# EAGLE board BeagleBone_Blue (EAGLE 7.4.0)
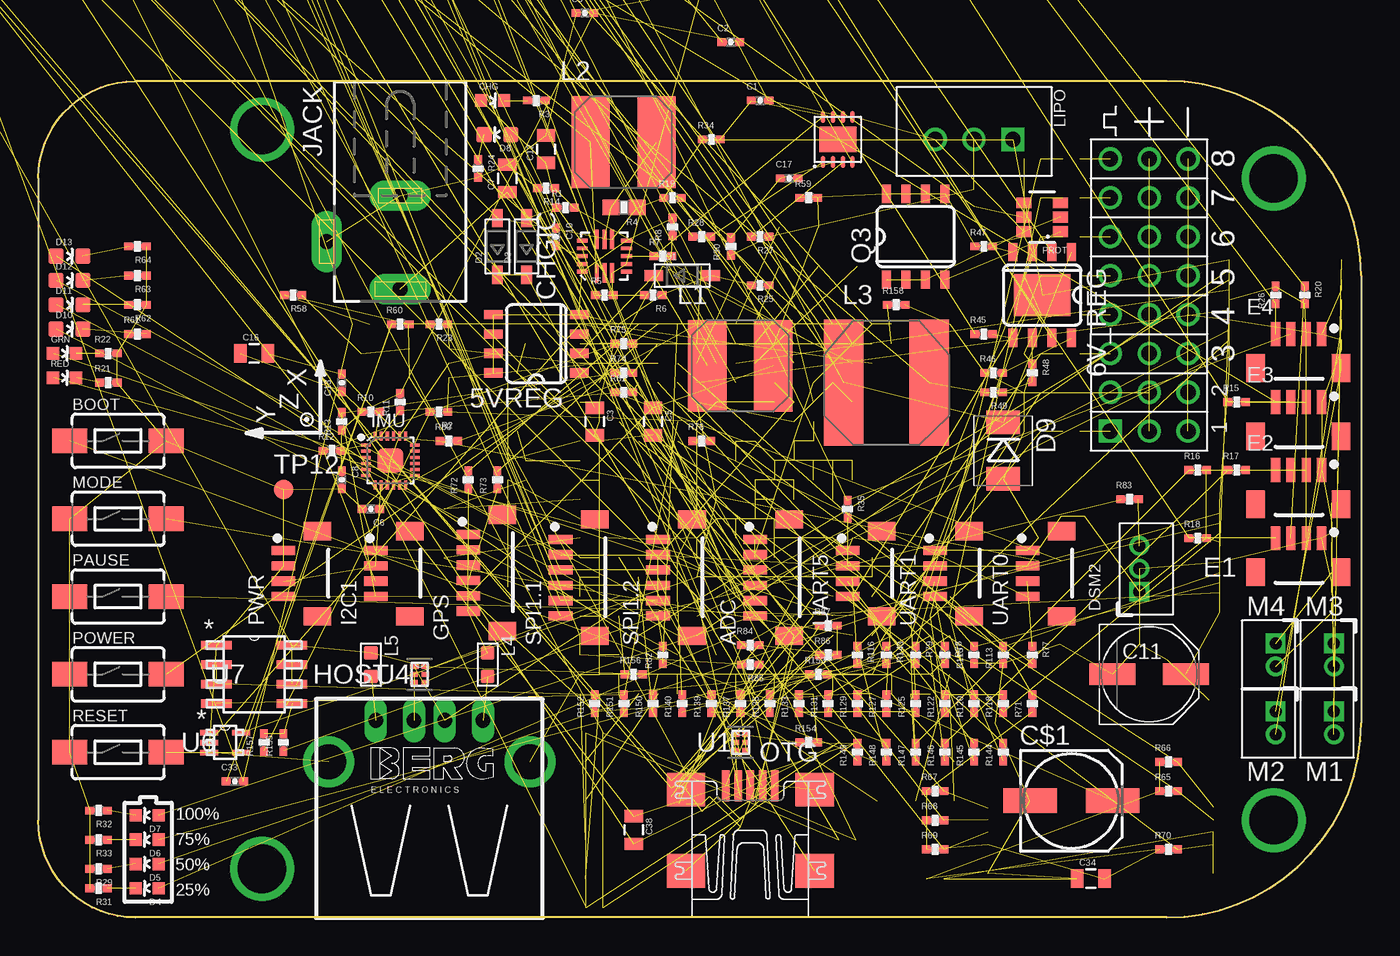
[diagram p4: board, top side]
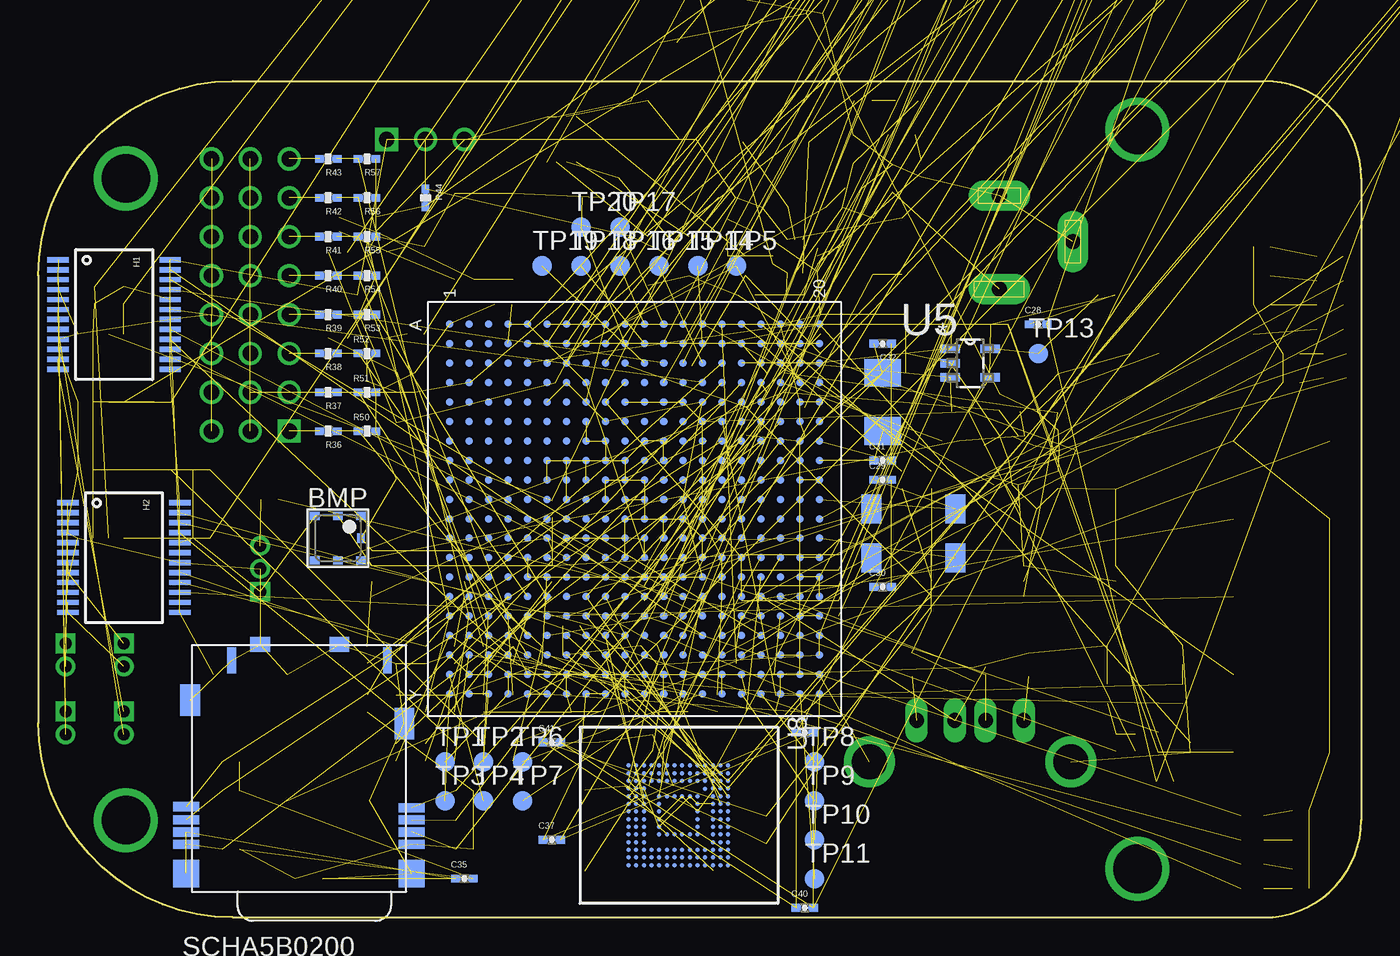
[diagram p5: board, bottom side, seen from below]

Size 86.36 x 54.61 mm. Coordinates in mm from the lower left corner, seen from the top.
Copper layers (1*16): Top 0.035mm / dielectric 1.5mm / Bottom 0.035mm
Design rules "default": minimum track width 10mil, minimum drill 24mil, track to track 8mil, track to pad 8mil, pad to pad 8mil, via to via 8mil, smd to smd 8mil, copper to edge 40mil, drill to drill 8mil, minimum pad ring 10mil, minimum via ring 8mil, stop-mask expansion 4mil, vias tented up to drill 0mil, thermal gap 10mil

## Footprints (pad centres in the part's own frame; a part is rotated, then mirrored left to right if it is on the bottom)
SO08-TIGHT = smd 0.6 x 1.2: 1 -1.905,-2.8; 2 -0.635,-2.8; 3 0.635,-2.8; 4 1.905,-2.8; 5 1.905,2.8; 6 0.635,2.8; 7 -0.635,2.8; 8 -1.905,2.8
SO08-EXPOSED = smd 0.6 x 1.2: 1 -1.905,-2.8; 2 -0.635,-2.8; 3 0.635,-2.8; 4 1.905,-2.8; 5 1.905,2.8; 6 0.635,2.8; 7 -0.635,2.8; 8 -1.905,2.8 | smd 3.683 x 2.718: 9 0,0
JST_SH_6 = smd 0.6 x 1.55: 1 5,0; 2 4,0; 3 3,0; 4 2,0; 5 1,0; 6 0,0 | smd 1.2 x 1.8: P$1 -1.3,-2.225; P$2 6.3,-2.225
8-SON_3X3MM = smd 0.305 x 0.813: 1 -0.965,-1.473; 2 -0.33,-1.473; 3 0.33,-1.473; 4 0.965,-1.473; 5 0.965,1.473; 6 0.33,1.473; 7 -0.33,1.473 | smd 0.305 x 0.787: 8 -0.965,1.473 | smd 2.4 x 1.651: PAD 0,0
BMP180 = smd 0.6 x 0.5: 1 1.5,1.45; 2 0,1.45; 3 -1.5,1.45; 4 -1.5,-1.45; 5 0,-1.45; 6 1.5,-1.45 | smd 0.5 x 0.6: 7 1.5,0
TACTILE-SWITCH-1101NE = smd 2.3 x 1.6: 1 -3.15,0; 2 3.15,0
0402-CAP = smd 0.61 x 0.508: 1 -0.559,0; 2 0.559,0
0805 = smd 0.8 x 1.2: 1 -0.9,0; 2 0.9,0
PANASONIC_D = smd 3 x 1.4: + 2.4,0; - -2.4,0
AVE107M06D16T-F = smd 3.5 x 1.6: + -10,2.54; - -15.4,2.54
LED-0603 = smd 0.8 x 0.8: A 0,-0.75; C 0,0.75
MP2615 = smd 1.295 x 0.254: 1 -1.092,0.508; 2 -1.092,0; 3 -1.092,-0.508; 9 1.092,-0.508; 10 1.092,0; 11 1.092,0.508 | smd 0.254 x 0.711: 4 -1.016,-1.448; 5 -0.508,-1.448; 6 0,-1.448; 7 0.508,-1.448; 8 1.016,-1.448; 12 1.016,1.448; 13 0.508,1.448; 14 0,1.448; 15 -0.508,1.448; 16 -1.016,1.448
SOD-123 = smd 1.2 x 0.7: A 1.85,0; C -1.85,0
LED-0603' = smd 1 x 1: A 0,-0.877; C 0,0.877
DO-214AA = smd 1.524 x 2.184: A 1.841,0; C -1.841,0
JST_ZH_3 = drill 0.787 square: P$1 0,0 | drill 0.787: P$2 1.499,0; P$3 2.997,0
JST_SH_4_SMD = smd 0.6 x 1.55: 1 0.46,1.27; 2 -0.54,1.27; 3 -1.54,1.27; 4 -2.54,1.27 | smd 1.2 x 1.8: P$1 -3.84,-0.955; P$2 1.728,-0.955
SSOP24 = smd 0.348 x 1.397: 1 -3.575,-3.656; 2 -2.925,-3.656; 3 -2.275,-3.656; 4 -1.625,-3.656; 5 -0.975,-3.656; 6 -0.325,-3.656; 7 0.325,-3.656; 8 0.975,-3.656; 9 1.625,-3.656; 10 2.275,-3.656; 11 2.925,-3.656; 12 3.575,-3.656; 13 3.575,3.656; 14 2.925,3.656; 15 2.275,3.656; 16 1.625,3.656; 17 0.975,3.656; 18 0.325,3.656; 19 -0.325,3.656; 20 -0.975,3.656; 21 -1.625,3.656; 22 -2.275,3.656; 23 -2.925,3.656; 24 -3.575,3.656
87520-0010BLF = drill 0.95 long: 1 -14.93,5.25; 2 -12.43,5.25; 3 -10.43,5.25; 4 -7.93,5.25 | drill 2.3 pad 2.9: S1 -18,2.54; S2 -4.86,2.54
QFN24G-0.4-3X3MM = smd 0.6 x 0.2: 1 -1.6,1; 2 -1.6,0.6; 3 -1.6,0.2; 4 -1.6,-0.2; 5 -1.6,-0.6; 6 -1.6,-1; 13 1.6,-1; 14 1.6,-0.6; 15 1.6,-0.2; 16 1.6,0.2; 17 1.6,0.6; 18 1.6,1 | smd 0.2 x 0.6: 7 -1,-1.6; 8 -0.6,-1.6; 9 -0.2,-1.6; 10 0.2,-1.6; 11 0.6,-1.6; 12 1,-1.6; 19 1,1.6; 20 0.6,1.6; 21 0.2,1.6; 22 -0.2,1.6; 23 -0.6,1.6; 24 -1,1.6 | smd 1.7 x 1.54: 25 0,0
DCJ0303 = drill 1 pad 2 long: 1 0,3.1; 2 4.8,0; 3 0,-3
SRN6045 = smd 2.5 x 6: 1 -2.175,-0.175; 2 2.125,-0.175
8X8MM_INDUCTOR = smd 2.591 x 8.204: 1 -2.794,0; 2 2.794,0
L0603 = smd 0.889 x 0.889: 1 -0.762,0; 2 0.762,0
JST_XH_3-PIN = drill 1 square: P$1 0,0 | drill 1: P$2 0,-2.54; P$3 0,-5.08
JST_ZH_2 = drill 0.787 pad 1.219 square: P$1 -0.749,0 | drill 0.787 pad 1.219: P$2 0.749,0
UX60SC-MB-5ST(80) = smd 2 x 0.5: 1 -11.72,4.14; 2 -11.72,3.34; 3 -11.72,2.54; 4 -11.72,1.74; 5 -11.72,0.94 | smd 2.2 x 2.5: M1 -17.27,-1.66; M2 -17.27,6.74; M3 -11.97,6.74; M4 -11.97,-1.66
SCHA5B0200 = smd 1.7 x 0.6: 1 18.78,8.437; 2 18.78,7.65; 3 18.78,6.85; 4 18.78,6.05; 5 4.08,6.05; 6 4.08,6.85; 7 4.08,7.65; 8 4.08,8.509 | smd 0.6 x 1.7: 9 7.044,18.05 | smd 0.549 x 1.7: 10 17.189,18.05 | smd 1.294 x 2.054: 11 4.334,15.456; 12 18.304,13.932 | smd 1.292 x 1: 13 8.894,19.1; 14 14.072,19.1 | smd 1.7 x 1.8: 15 4.08,4.15; 16 18.78,4.15
SOT-236 = smd 0.991 x 0.711: 1 -1.194,0.94; 2 -1.194,0; 3 -1.194,-0.94; 4 1.194,-0.94; 5 1.194,0; 6 1.194,0.94
0402-RES = smd 0.61 x 0.508: 1 -0.559,0; 2 0.559,0
0603-RES = smd 1.1 x 1: 1 -0.85,0; 2 0.85,0
OSD3358 = smd 0.5 x 0.5: A1 -12.065,-12.065; A2 -12.065,-10.795; A3 -12.065,-9.525; A4 -12.065,-8.255; A5 -12.065,-6.985; A6 -12.065,-5.715; A7 -12.065,-4.445; A8 -12.065,-3.175; A9 -12.065,-1.905; A10 -12.065,-0.635; A11 -12.065,0.635; A12 -12.065,1.905; A13 -12.065,3.175; A14 -12.065,4.445; A15 -12.065,5.715; A16 -12.065,6.985; A17 -12.065,8.255; A18 -12.065,9.525; A19 -12.065,10.795; A20 -12.065,12.065; B1 -10.795,-12.065; B2 -10.795,-10.795; B3 -10.795,-9.525; B4 -10.795,-8.255; B5 -10.795,-6.985; B6 -10.795,-5.715; B7 -10.795,-4.445; B8 -10.795,-3.175; B9 -10.795,-1.905; B10 -10.795,-0.635; B11 -10.795,0.635; B12 -10.795,1.905; B13 -10.795,3.175; B14 -10.795,4.445; B15 -10.795,5.715; B16 -10.795,6.985; B17 -10.795,8.255; B18 -10.795,9.525; B19 -10.795,10.795; B20 -10.795,12.065; C1 -9.525,-12.065; C2 -9.525,-10.795; C3 -9.525,-9.525; C4 -9.525,-8.255; C5 -9.525,-6.985; C6 -9.525,-5.715; C7 -9.525,-4.445; C8 -9.525,-3.175; C9 -9.525,-1.905; C10 -9.525,-0.635; C11 -9.525,0.635; C12 -9.525,1.905; C13 -9.525,3.175; C14 -9.525,4.445; C15 -9.525,5.715; C16 -9.525,6.985; C17 -9.525,8.255; C18 -9.525,9.525; C19 -9.525,10.795; C20 -9.525,12.065; D1 -8.255,-12.065; D2 -8.255,-10.795; D3 -8.255,-9.525; D4 -8.255,-8.255; D5 -8.255,-6.985; D6 -8.255,-5.715; D7 -8.255,-4.445; D8 -8.255,-3.175; D9 -8.255,-1.905; D10 -8.255,-0.635; D11 -8.255,0.635; D12 -8.255,1.905; D13 -8.255,3.175; D14 -8.255,4.445; D15 -8.255,5.715; D16 -8.255,6.985; D17 -8.255,8.255; D18 -8.255,9.525; D19 -8.255,10.795; D20 -8.255,12.065; E1 -6.985,-12.065; E2 -6.985,-10.795; E3 -6.985,-9.525; E4 -6.985,-8.255; E5 -6.985,-6.985; E6 -6.985,-5.715; E7 -6.985,-4.445; E8 -6.985,-3.175; E9 -6.985,-1.905; E10 -6.985,-0.635; E11 -6.985,0.635; E12 -6.985,1.905; E13 -6.985,3.175; E14 -6.985,4.445; E15 -6.985,5.715; E16 -6.985,6.985; E17 -6.985,8.255; E18 -6.985,9.525; E19 -6.985,10.795; E20 -6.985,12.065; F1 -5.715,-12.065; F2 -5.715,-10.795; F3 -5.715,-9.525; F4 -5.715,-8.255; F5 -5.715,-6.985; F6 -5.715,-5.715; F7 -5.715,-4.445; F8 -5.715,-3.175; F9 -5.715,-1.905; F10 -5.715,-0.635; F11 -5.715,0.635; F12 -5.715,1.905; F13 -5.715,3.175; F14 -5.715,4.445; F15 -5.715,5.715; F16 -5.715,6.985; F17 -5.715,8.255; F18 -5.715,9.525; F19 -5.715,10.795; F20 -5.715,12.065; G1 -4.445,-12.065; G2 -4.445,-10.795; G3 -4.445,-9.525; G4 -4.445,-8.255; G5 -4.445,-6.985; G6 -4.445,-5.715; G7 -4.445,-4.445; G8 -4.445,-3.175; G9 -4.445,-1.905; G10 -4.445,-0.635; G11 -4.445,0.635; G12 -4.445,1.905; G13 -4.445,3.175; G14 -4.445,4.445; G15 -4.445,5.715; G16 -4.445,6.985; G17 -4.445,8.255; G18 -4.445,9.525; G19 -4.445,10.795; G20 -4.445,12.065; H1 -3.175,-12.065; H2 -3.175,-10.795; H3 -3.175,-9.525; H4 -3.175,-8.255; H5 -3.175,-6.985; H6 -3.175,-5.715; H7 -3.175,-4.445; H8 -3.175,-3.175; H9 -3.175,-1.905; H10 -3.175,-0.635; H11 -3.175,0.635; H12 -3.175,1.905; H13 -3.175,3.175; H14 -3.175,4.445; H15 -3.175,5.715; H16 -3.175,6.985; H17 -3.175,8.255; H18 -3.175,9.525; H19 -3.175,10.795; H20 -3.175,12.065; J1 -1.905,-12.065; J2 -1.905,-10.795; J3 -1.905,-9.525; J4 -1.905,-8.255; J5 -1.905,-6.985; J6 -1.905,-5.715; J7 -1.905,-4.445; J8 -1.905,-3.175; J9 -1.905,-1.905; J10 -1.905,-0.635; J11 -1.905,0.635; J12 -1.905,1.905; J13 -1.905,3.175; J14 -1.905,4.445; J15 -1.905,5.715; J16 -1.905,6.985; J17 -1.905,8.255; J18 -1.905,9.525; J19 -1.905,10.795; J20 -1.905,12.065; K1 -0.635,-12.065; K2 -0.635,-10.795; K3 -0.635,-9.525; K4 -0.635,-8.255; K5 -0.635,-6.985; K6 -0.635,-5.715; K7 -0.635,-4.445; K8 -0.635,-3.175; K9 -0.635,-1.905; K10 -0.635,-0.635; K11 -0.635,0.635; K12 -0.635,1.905; K13 -0.635,3.175; K14 -0.635,4.445; K15 -0.635,5.715; K16 -0.635,6.985; K17 -0.635,8.255; K18 -0.635,9.525; K19 -0.635,10.795; K20 -0.635,12.065; L1 0.635,-12.065; L2 0.635,-10.795; L3 0.635,-9.525; L4 0.635,-8.255; L5 0.635,-6.985; L6 0.635,-5.715; L7 0.635,-4.445; L8 0.635,-3.175; L9 0.635,-1.905; L10 0.635,-0.635; L11 0.635,0.635; L12 0.635,1.905; L13 0.635,3.175; L14 0.635,4.445; L15 0.635,5.715; L16 0.635,6.985; L17 0.635,8.255; L18 0.635,9.525; L19 0.635,10.795; L20 0.635,12.065; M1 1.905,-12.065; M2 1.905,-10.795; M3 1.905,-9.525; M4 1.905,-8.255; M5 1.905,-6.985; M6 1.905,-5.715; M7 1.905,-4.445; M8 1.905,-3.175; M9 1.905,-1.905; M10 1.905,-0.635; M11 1.905,0.635; M12 1.905,1.905; M13 1.905,3.175; M14 1.905,4.445; M15 1.905,5.715; M16 1.905,6.985; M17 1.905,8.255; M18 1.905,9.525; M19 1.905,10.795; M20 1.905,12.065; N1 3.175,-12.065; N2 3.175,-10.795; N3 3.175,-9.525; N4 3.175,-8.255; N5 3.175,-6.985; N6 3.175,-5.715; N7 3.175,-4.445; N8 3.175,-3.175; N9 3.175,-1.905; N10 3.175,-0.635; N11 3.175,0.635; N12 3.175,1.905; N13 3.175,3.175; N14 3.175,4.445; N15 3.175,5.715; N16 3.175,6.985; N17 3.175,8.255; N18 3.175,9.525; N19 3.175,10.795; N20 3.175,12.065; P1 4.445,-12.065; P2 4.445,-10.795; P3 4.445,-9.525; P4 4.445,-8.255; P5 4.445,-6.985; P6 4.445,-5.715; P7 4.445,-4.445; P8 4.445,-3.175; P9 4.445,-1.905; P10 4.445,-0.635; P11 4.445,0.635; P12 4.445,1.905; P13 4.445,3.175; P14 4.445,4.445; P15 4.445,5.715; P16 4.445,6.985; P17 4.445,8.255; P18 4.445,9.525; P19 4.445,10.795; P20 4.445,12.065; R1 5.715,-12.065; R2 5.715,-10.795; R3 5.715,-9.525; R4 5.715,-8.255; R5 5.715,-6.985; R6 5.715,-5.715; R7 5.715,-4.445; R8 5.715,-3.175; R9 5.715,-1.905; R10 5.715,-0.635; R11 5.715,0.635; R12 5.715,1.905; R13 5.715,3.175; R14 5.715,4.445; R15 5.715,5.715; R16 5.715,6.985; R17 5.715,8.255; R18 5.715,9.525; R19 5.715,10.795; R20 5.715,12.065; T1 6.985,-12.065; T2 6.985,-10.795; T3 6.985,-9.525; T4 6.985,-8.255; T5 6.985,-6.985; T6 6.985,-5.715; T7 6.985,-4.445; T8 6.985,-3.175; T9 6.985,-1.905; T10 6.985,-0.635; T11 6.985,0.635; T12 6.985,1.905; T13 6.985,3.175; T14 6.985,4.445; T15 6.985,5.715; T16 6.985,6.985; T17 6.985,8.255; T18 6.985,9.525; T19 6.985,10.795; T20 6.985,12.065; U1 8.255,-12.065; U2 8.255,-10.795; U3 8.255,-9.525; U4 8.255,-8.255; U5 8.255,-6.985; U6 8.255,-5.715; U7 8.255,-4.445; U8 8.255,-3.175; U9 8.255,-1.905; U10 8.255,-0.635; U11 8.255,0.635; U12 8.255,1.905; U13 8.255,3.175; U14 8.255,4.445; U15 8.255,5.715; U16 8.255,6.985; U17 8.255,8.255; U18 8.255,9.525; U19 8.255,10.795; U20 8.255,12.065; V1 9.525,-12.065; V2 9.525,-10.795; V3 9.525,-9.525; V4 9.525,-8.255; V5 9.525,-6.985; V6 9.525,-5.715; V7 9.525,-4.445; V8 9.525,-3.175; V9 9.525,-1.905; V10 9.525,-0.635; V11 9.525,0.635; V12 9.525,1.905; V13 9.525,3.175; V14 9.525,4.445; V15 9.525,5.715; V16 9.525,6.985; V17 9.525,8.255; V18 9.525,9.525; V19 9.525,10.795; V20 9.525,12.065; W1 10.795,-12.065; W2 10.795,-10.795; W3 10.795,-9.525; W4 10.795,-8.255; W5 10.795,-6.985; W6 10.795,-5.715; W7 10.795,-4.445; W8 10.795,-3.175; W9 10.795,-1.905; W10 10.795,-0.635; W11 10.795,0.635; W12 10.795,1.905; W13 10.795,3.175; W14 10.795,4.445; W15 10.795,5.715; W16 10.795,6.985; W17 10.795,8.255; W18 10.795,9.525; W19 10.795,10.795; W20 10.795,12.065; Y1 12.065,-12.065; Y2 12.065,-10.795; Y3 12.065,-9.525; Y4 12.065,-8.255; Y5 12.065,-6.985; Y6 12.065,-5.715; Y7 12.065,-4.445; Y8 12.065,-3.175; Y9 12.065,-1.905; Y10 12.065,-0.635; Y11 12.065,0.635; Y12 12.065,1.905; Y13 12.065,3.175; Y14 12.065,4.445; Y15 12.065,5.715; Y16 12.065,6.985; Y17 12.065,8.255; Y18 12.065,9.525; Y19 12.065,10.795; Y20 12.065,12.065
B1,27 = smd 1.27 x 1.27: TP 0,0
DRY6 = smd 0.559 x 0.305: 1 -0.355,0.5 | smd 0.508 x 0.305: 2 -0.37,0; 3 -0.37,-0.5; 4 0.37,-0.5; 5 0.37,0; 6 0.37,0.5
SOT95P290X145-5N = smd 1.27 x 0.559: 1 -1.295,0.94; 2 -1.295,0; 3 -1.295,-0.94; 4 1.295,-0.94; 5 1.295,0.94
DCK5 = smd 1.168 x 0.356: 1 -1.041,0.65; 2 -1.041,0; 3 -1.041,-0.65; 4 1.041,-0.65; 5 1.041,0.65
D8 = smd 1.981 x 0.559: 1 -2.464,1.905; 2 -2.464,0.635; 3 -2.464,-0.635; 4 -2.464,-1.905; 5 2.464,-1.905; 6 2.464,-0.635; 7 2.464,0.635; 8 2.464,1.905
MTFC4GLDEA = smd 0.3 x 0.3: A1 -3.25,3.25; A2 -2.75,3.25; A3 -2.25,3.25; A4 -1.75,3.25; A5 -1.25,3.25; A6 -0.75,3.25; A7 -0.25,3.25; A8 0.25,3.25; A9 0.75,3.25; A10 1.25,3.25; A11 1.75,3.25; A12 2.25,3.25; A13 2.75,3.25; A14 3.25,3.25; B1 -3.25,2.75; B2 -2.75,2.75; B3 -2.25,2.75; B4 -1.75,2.75; B5 -1.25,2.75; B6 -0.75,2.75; B7 -0.25,2.75; B8 0.25,2.75; B9 0.75,2.75; B10 1.25,2.75; B11 1.75,2.75; B12 2.25,2.75; B13 2.75,2.75; B14 3.25,2.75; C1 -3.25,2.25; C2 -2.75,2.25; C3 -2.25,2.25; C4 -1.75,2.25; C5 -1.25,2.25; C6 -0.75,2.25; C7 -0.25,2.25; C8 0.25,2.25; C9 0.75,2.25; C10 1.25,2.25; C11 1.75,2.25; C12 2.25,2.25; C13 2.75,2.25; C14 3.25,2.25; D1 -3.25,1.75; D2 -2.75,1.75; D3 -2.25,1.75; D4 -1.727,1.75; D12 2.25,1.75; D13 2.75,1.75; D14 3.25,1.75; E1 -3.25,1.25; E2 -2.75,1.25; E3 -2.25,1.25; E5 -1.25,1.25; E6 -0.75,1.25; E7 -0.25,1.25; E8 0.25,1.25; E9 0.75,1.25; E10 1.25,1.25; E12 2.25,1.25; E13 2.75,1.25; E14 3.25,1.25; F1 -3.25,0.75; F2 -2.75,0.75; F3 -2.25,0.75; F5 -1.25,0.75; F10 1.25,0.75; F12 2.25,0.75; F13 2.75,0.75; F14 3.25,0.75; G1 -3.25,0.25; G2 -2.75,0.25; G3 -2.25,0.25; G5 -1.25,0.25; G10 1.25,0.25; G12 2.25,0.25; G13 2.75,0.25; G14 3.25,0.25; H1 -3.25,-0.25; H2 -2.75,-0.25; H3 -2.25,-0.25; H5 -1.25,-0.25; H10 1.25,-0.25; H12 2.25,-0.25; H13 2.75,-0.25; H14 3.25,-0.25; J1 -3.25,-0.75; J2 -2.75,-0.75; J3 -2.25,-0.75; J5 -1.25,-0.75; J10 1.25,-0.75; J12 2.25,-0.75; J13 2.75,-0.75; J14 3.25,-0.75; K1 -3.25,-1.25; K2 -2.75,-1.25; K3 -2.25,-1.25; K5 -1.25,-1.25; K6 -0.75,-1.25; K7 -0.25,-1.25; K8 0.25,-1.25; K9 0.75,-1.25; K10 1.25,-1.25; K12 2.25,-1.25; K13 2.75,-1.25; K14 3.25,-1.25; L1 -3.25,-1.75; L2 -2.75,-1.75; L3 -2.25,-1.75; L12 2.25,-1.75; L13 2.75,-1.75; L14 3.25,-1.75; M1 -3.25,-2.25; M2 -2.75,-2.25; M3 -2.25,-2.25; M4 -1.75,-2.25; M5 -1.25,-2.25; M6 -0.75,-2.25; M7 -0.25,-2.25; M8 0.25,-2.25; M9 0.75,-2.25; M10 1.25,-2.25; M11 1.75,-2.25; M12 2.25,-2.25; M13 2.75,-2.25; M14 3.25,-2.25; N1 -3.25,-2.75; N2 -2.75,-2.75; N3 -2.25,-2.75; N4 -1.75,-2.75; N5 -1.25,-2.75; N6 -0.75,-2.75; N7 -0.25,-2.75; N8 0.25,-2.75; N9 0.75,-2.75; N10 1.25,-2.75; N11 1.75,-2.75; N12 2.25,-2.75; N13 2.75,-2.75; N14 3.25,-2.75; P1 -3.25,-3.25; P2 -2.75,-3.25; P3 -2.25,-3.25; P4 -1.75,-3.25; P5 -1.25,-3.25; P6 -0.75,-3.25; P7 -0.25,-3.25; P8 0.25,-3.25; P9 0.75,-3.25; P10 1.25,-3.25; P11 1.75,-3.25; P12 2.25,-3.25; P13 2.75,-3.25; P14 3.25,-3.25
3X8_0.1"_HEADER = drill 1 square: P$1 -2.54,-17.78 | drill 1: P$2 -2.54,-15.24; P$3 -2.54,-12.7; P$4 -2.54,-10.16; P$5 -2.54,-7.62; P$6 -2.54,-5.08; P$7 0,-17.78; P$8 0,-15.24; P$9 0,-12.7; P$10 0,-10.16; P$11 0,-7.62; P$12 0,-5.08; P$13 2.54,-17.78; P$14 2.54,-15.24; P$15 2.54,-12.7; P$16 2.54,-10.16; P$17 2.54,-7.62; P$18 2.54,-5.08; P$19 -2.54,-2.54; P$20 -2.54,0; P$21 0,-2.54; P$22 0,0; P$23 2.54,-2.54; P$24 2.54,0
CM200C-32.768KAZF-UT = smd 1.3 x 1.9: 1 1.27,2.54; 2 1.27,5.74; 3 6.77,2.54; 4 6.77,5.74
445C33D24M00000 = smd 1.8 x 2.4: 1 1.27,2.54; 2 5.07,2.54

## Placement (x,y rotation side)
5VREG  AP1509SOIC-8-TIGHT  [SO08-TIGHT]  32.51,37.47 90 top
6V_REG  AOZ1284  [SO08-EXPOSED]  65.53,40.64 180 top
ADC  JST_SH_6  [JST_SH_6]  46.8,19.69 90 top
BAL  BQ29209  [8-SON_3X3MM]  52.2,50.8 0 top
BMP  BMP180  [BMP180]  66.8,24.77 0 bottom
BOARD  [BEAGLEBONE_BLUE_NO_HOLES]  0,54.61 270 top
BOOT  SWITCH-MOMENTARY-2SMD-1101NE  [TACTILE-SWITCH-1101NE]  5.21,31.11 0 top
C1  0.1uF  [0402-CAP]  47.12,53.34 0 top
C2  0.1uF  [0402-CAP]  45.21,57.15 0 top
C3  10uF 25V  [0805]  36.32,32.38 270 top
C4  1uF  [0402-CAP]  42.67,60.33 0 top  (outside the outline)
C5  10uF 25V  [0805]  40.13,32.38 270 top
C6  0.1uF  [0402-CAP]  21.72,26.67 180 top
C7  10uF 25V  [0805]  30.61,48.26 90 top
C8  0.1uF  [0402-CAP]  19.81,28.57 270 top
C9  0.1uF  [0402-CAP]  35.69,59.05 0 top  (outside the outline)
C10  1uF  [0402-CAP]  33.78,44.45 270 top
C11  100uF 16V  [PANASONIC_D]  72.52,15.88 0 top
C12  10uF 25V  [0805]  33.15,50.16 90 top
C13  0.1uF  [0402-CAP]  19.81,34.92 90 top
C14  0.1uF  [0402-CAP]  -101.47,163.83 0 top  (outside the outline)
C15  0.1uF  [0402-CAP]  -104.01,163.83 0 top  (outside the outline)
C16  10uF 25V  [0805]  14.1,36.83 0 top
C17  0.1uF  [0402-CAP]  49.02,48.26 0 top
C18  0.1uF  [0402-CAP]  -109.09,163.83 0 top  (outside the outline)
C19  0.1uF  [0402-CAP]  -13.84,167.64 0 top  (outside the outline)
C20  10uF 25V  [0805]  -86.23,160.02 0 top  (outside the outline)
C21  2.2nF 50V  [0402-CAP]  -16.38,167.64 0 top  (outside the outline)
C22  0.1uF  [0402-CAP]  -18.92,167.64 0 top  (outside the outline)
C23  10uF 25V  [0805]  -90.04,160.02 0 top  (outside the outline)
C24  0.1uF  [0402-CAP]  -21.46,167.64 0 top  (outside the outline)
C25  10uF 25V  [0805]  -93.85,160.02 0 top  (outside the outline)
C26  10uF 25V  [0805]  -97.66,160.02 0 top  (outside the outline)
C27  0.1UF,6.3V  [0402-CAP]  -24,167.64 0 top  (outside the outline)
C28  0.1UF,6.3V  [0402-CAP]  21.08,38.73 0 bottom
C29  18PF,50V  [0402-CAP]  31.24,28.57 0 bottom
C30  18PF,50V  [0402-CAP]  31.24,21.59 0 bottom
C31  18PF,50V  [0402-CAP]  31.24,29.84 0 bottom
C32  18PF,50V  [0402-CAP]  31.24,37.47 180 bottom
C33  2.2UF,6.3V  [0402-CAP]  12.83,8.89 0 top
C34  10UF,10V  [0805]  68.71,2.54 0 top
C35  0.1UF,6.3V  [0402-CAP]  58.55,2.54 0 bottom
C36  2.2UF,6.3V  [0402-CAP]  -44.32,167.64 0 top  (outside the outline)
C37  0.1UF,6.3V  [0402-CAP]  52.83,5.08 0 bottom
C38  10UF,10V  [0805]  38.86,5.71 270 top
C39  0.1UF,6.3V  [0402-CAP]  36.32,12.06 0 bottom
C40  0.1UF,6.3V  [0402-CAP]  36.32,0.63 0 bottom
C41  0.1UF,6.3V  [0402-CAP]  52.83,11.43 0 bottom
C42  0.001UF,16V  [0402-CAP]  -57.02,167.64 0 top  (outside the outline)
C43  0.1UF,6.3V  [0402-CAP]  -59.56,167.64 0 top  (outside the outline)
C44  0.1UF,6.3V  [0402-CAP]  -62.1,167.64 0 top  (outside the outline)
C45  0.1UF,6.3V  [0402-CAP]  -64.64,167.64 0 top  (outside the outline)
C46  10UF,10V  [0805]  -63.37,160.02 0 top  (outside the outline)
C$1  AVE107M06D16T-F  [AVE107M06D16T-F]  80.14,5.08 0 top
CHG  GRN  [LED-0603]  29.65,53.34 270 top
CHGIC  MP2615  [MP2615]  36.96,43.18 90 top
D1  [SOD-123]  42.04,41.91 0 top
D2  [SOD-123]  29.97,43.81 90 top
D3  [SOD-123]  31.88,43.81 90 top
D4  RED  [LED-0603]  7.11,1.91 90 top
D5  GREEN  [LED-0603]  7.11,3.49 90 top
D6  GREEN  [LED-0603]  7.11,5.08 90 top
D7  GREEN  [LED-0603]  7.11,6.67 90 top
D8  BLUE  [LED-0603']  29.97,51.12 90 top
D9  [DO-214AA]  62.99,30.48 270 top
D10  BLUE  [LED-0603']  2.03,38.42 270 top
D11  BLUE  [LED-0603']  2.03,40 270 top
D12  BLUE  [LED-0603']  2.03,41.59 270 top
D13  BLUE  [LED-0603']  2.03,43.18 270 top
DSM2  JST_ZH_3  [JST_ZH_3]  71.88,21.27 90 top
E1  JST_SH_4  [JST_SH_4_SMD]  83.31,23.5 0 top
E2  JST_SH_4  [JST_SH_4_SMD]  83.31,27.94 0 top
E3  JST_SH_4  [JST_SH_4_SMD]  83.31,32.38 0 top
E4  JST_SH_4  [JST_SH_4_SMD]  83.31,36.83 0 top
E$1  [BATTERY_INDICATOR]  7.18,4.19 270 top
GPS  JST_SH_6  [JST_SH_6]  28.07,20 90 top
GRN  GRN  [LED-0603]  1.71,36.83 270 top
H1  TB6621FNG  [SSOP24]  81.41,39.37 270 bottom
H2  TB6621FNG  [SSOP24]  80.77,23.5 270 bottom
HOST  87520-0010BLF  [87520-0010BLF]  36.96,7.62 0 top
I2C1  JST_SH_4  [JST_SH_4_SMD]  23.3,23.5 90 top
IMU  MPU-9250  [QFN24G-0.4-3X3MM]  22.99,29.84 0 top
JACK  5.5x2.1mm  [DCJ0303]  23.62,44.13 180 top
L1  6.8uH  [SRN6045]  45.85,36.2 0 top
L2  6.8uH  [SRN6045]  38.23,50.8 0 top
L3  3.6  [8X8MM_INDUCTOR]  55.37,34.92 0 top
L4  120  [L0603]  29.34,16.51 270 top
L5  120  [L0603]  21.72,16.51 270 top
LIPO  [JST_XH_3-PIN]  63.63,50.8 270 top
M1  JST_ZH_2  [JST_ZH_2]  84.58,12.7 270 top
M2  JST_ZH_2  [JST_ZH_2]  80.77,12.7 270 top
M3  JST_ZH_2  [JST_ZH_2]  84.58,17.14 270 top
M4  JST_ZH_2  [JST_ZH_2]  80.77,17.14 270 top
MODE  SWITCH-MOMENTARY-2SMD-1101NE  [TACTILE-SWITCH-1101NE]  5.21,26.04 0 top
OTG  UX60SC-MB-5ST(80)  [UX60SC-MB-5ST(80)]  49.02,20.32 90 top
P10  SCHA5B0200  [SCHA5B0200]  80.77,-1.27 0 bottom
PAUSE  SWITCH-MOMENTARY-2SMD-1101NE  [TACTILE-SWITCH-1101NE]  5.21,20.95 0 top
POWER  SWITCH-MOMENTARY-2SMD-1101NE  [TACTILE-SWITCH-1101NE]  5.21,15.88 0 top
PROT  S-8261  [SOT-236]  65.53,45.72 180 top
PWR  JST_SH_4  [JST_SH_4_SMD]  17.27,23.5 90 top
Q3  MOSFET-N  [SO08-TIGHT]  57.28,44.45 0 top
R1  47k  [0402-RES]  34.42,46.35 0 top
R2  1.5K,1%  [0402-RES]  26.16,33.02 180 top
R3  1k  [0402-RES]  32.51,53.34 180 top
R4  0.1  [0603-RES]  38.23,46.35 180 top
R5  10k  [0402-RES]  36.96,40.64 0 top
R6  10k  [0402-RES]  40.13,40.64 180 top
R7  4.7k  [0402-RES]  40.77,43.18 0 top
R8  10k  [0402-RES]  41.4,45.09 90 top
R9  1K  [0402-RES]  33.78,62.23 0 top  (outside the outline)
R10  4.7k  [0402-RES]  21.72,33.02 0 top
R11  4.7k  [0402-RES]  23.62,33.66 90 top
R12  4.7k  [0402-RES]  19.18,30.48 0 top
R13  4.7k  [0402-RES]  19.81,32.38 90 top
R14  4.7k  [0402-RES]  33.15,47.62 180 top
R15  1K  [0402-RES]  78.23,33.66 0 top
R16  1K  [0402-RES]  75.69,29.21 0 top
R17  1K  [0402-RES]  78.23,29.21 0 top
R18  1K  [0402-RES]  75.69,24.77 0 top
R19  47k  [0402-RES]  41.4,46.99 0 top
R20  1K  [0402-RES]  82.68,40.64 270 top
R21  261  [0402-RES]  4.57,34.92 0 top
R22  261  [0402-RES]  4.57,36.83 0 top
R23  1.5K,1%  [0402-RES]  26.16,38.73 180 top
R24  4.75K,1%  [0402-RES]  28.7,48.89 270 top
R25  4.7k  [0402-RES]  47.12,41.27 180 top
R26  1K  [0402-RES]  80.77,40.64 90 top
R27  160  [0402-RES]  47.12,44.45 180 top
R28  160  [0402-RES]  43.31,44.45 0 top
R29  261  [0402-RES]  3.94,3.17 180 top
R30  261  [0402-RES]  45.21,43.81 90 top
R31  261  [0402-RES]  3.94,1.91 180 top
R32  261  [0402-RES]  3.94,6.98 180 top
R33  261  [0402-RES]  3.94,5.08 180 top
R34  160  [0402-RES]  43.94,50.8 0 top
R35  1K  [0402-RES]  52.83,26.67 270 top
R36  4.7k  [0402-RES]  67.44,31.75 180 bottom
R37  4.7k  [0402-RES]  67.44,34.29 180 bottom
R38  4.7k  [0402-RES]  67.44,36.83 180 bottom
R39  4.7k  [0402-RES]  67.44,39.37 180 bottom
R40  4.7k  [0402-RES]  67.44,41.91 180 bottom
R41  4.7k  [0402-RES]  67.44,44.45 180 bottom
R42  4.7k  [0402-RES]  67.44,46.99 180 bottom
R43  4.7k  [0402-RES]  67.44,49.53 180 bottom
R44  1k  [0402-RES]  61.09,46.99 270 bottom
R45  47k  [0402-RES]  61.72,38.1 0 top
R46  1K  [0402-RES]  62.36,35.56 0 top
R47  100k  [0402-RES]  61.72,43.81 0 top
R48  10k  [0402-RES]  64.9,35.56 270 top
R49  65k  [0402-RES]  62.36,34.29 180 top
R50  4.7k  [0402-RES]  64.9,31.75 0 bottom
R51  4.7k  [0402-RES]  64.9,34.29 0 bottom
R52  4.7k  [0402-RES]  64.9,36.83 0 bottom
R53  4.7k  [0402-RES]  64.9,39.37 180 bottom
R54  4.7k  [0402-RES]  64.9,41.91 180 bottom
R55  4.7k  [0402-RES]  64.9,44.45 180 bottom
R56  4.7k  [0402-RES]  64.9,46.99 180 bottom
R57  4.7k  [0402-RES]  64.9,49.53 180 bottom
R58  1.5K,1%  [0402-RES]  16.64,40.64 180 top
R59  4.7K,1%  [0402-RES]  50.29,46.99 0 top
R60  10K,1%  [0402-RES]  23.62,38.73 0 top
R61  261  [0402-RES]  6.48,38.1 0 top
R62  261  [0402-RES]  6.48,40 180 top
R63  261  [0402-RES]  6.48,41.91 180 top
R64  261  [0402-RES]  6.48,43.81 180 top
R65  10K,1%  [0402-RES]  73.79,8.26 0 top
R66  10K,1%  [0402-RES]  73.79,10.16 0 top
R67  10K,1%  [0402-RES]  58.55,8.26 0 top
R68  10K,1%  [0402-RES]  58.55,6.35 0 top
R69  10K,1%  [0402-RES]  58.55,4.45 0 top
R70  10K,1%  [0402-RES]  73.79,4.45 0 top
R71  10K,1%  [0402-RES]  64.9,13.97 90 top
R72  33  [0402-RES]  28.07,28.57 90 top
R73  33  [0402-RES]  29.97,28.57 90 top
R74  0  [0402-RES]  38.23,35.56 0 top
R75  0  [0402-RES]  38.23,37.47 0 top
R76  33  [0402-RES]  43.31,31.11 0 top
R77  33  [0402-RES]  64.9,17.14 270 top
R78  33  [0402-RES]  59.18,17.14 270 top
R79  33  [0402-RES]  57.28,17.14 270 top
R80  0  [0402-RES]  26.8,31.11 0 top
R81  0  [0402-RES]  38.23,34.29 0 top
R82  33  [0402-RES]  40.77,17.14 90 top
R83  33  [0402-RES]  71.25,27.3 0 top
R84  10K,1%  [0402-RES]  46.48,17.78 0 top
R85  10K,1%  [0402-RES]  46.48,16.51 180 top
R86  10K,1%  [0402-RES]  51.56,17.14 0 top
R87  10K,1%  [0402-RES]  51.56,19.05 0 top
R88  10K,1%  [0402-RES]  -92.58,172.72 0 top  (outside the outline)
R89  10K,1%  [0402-RES]  -95.12,172.72 0 top  (outside the outline)
R90  10K,1%  [0402-RES]  -97.66,172.72 0 top  (outside the outline)
R91  10K,1%  [0402-RES]  -100.2,172.72 0 top  (outside the outline)
R92  10K,1%  [0402-RES]  -102.74,172.72 0 top  (outside the outline)
R93  10K,1%  [0402-RES]  -105.28,172.72 0 top  (outside the outline)
R94  10K,1%  [0402-RES]  -107.82,172.72 0 top  (outside the outline)
R95  33  [0402-RES]  -13.84,175.26 0 top  (outside the outline)
R96  33  [0402-RES]  -16.38,175.26 0 top  (outside the outline)
R97  33  [0402-RES]  -18.92,175.26 0 top  (outside the outline)
R98  33  [0402-RES]  -21.46,175.26 0 top  (outside the outline)
R99  33  [0402-RES]  -24,175.26 0 top  (outside the outline)
R100  33  [0402-RES]  -26.54,175.26 0 top  (outside the outline)
R101  33  [0402-RES]  -29.08,175.26 0 top  (outside the outline)
R102  33  [0402-RES]  -31.62,175.26 0 top  (outside the outline)
R103  33  [0402-RES]  -34.16,175.26 0 top  (outside the outline)
R104  33  [0402-RES]  -36.7,175.26 0 top  (outside the outline)
R105  0  [0402-RES]  -39.24,175.26 0 top  (outside the outline)
R106  0  [0402-RES]  -41.78,175.26 0 top  (outside the outline)
R107  0  [0402-RES]  -44.32,175.26 0 top  (outside the outline)
R108  0  [0402-RES]  -46.86,175.26 0 top  (outside the outline)
R109  4.75K,1%  [0402-RES]  -49.4,175.26 0 top  (outside the outline)
R110  4.75K,1%  [0402-RES]  -51.94,175.26 0 top  (outside the outline)
R111  0  [0402-RES]  -54.48,175.26 0 top  (outside the outline)
R113  100K,1%  [0402-RES]  62.99,17.14 90 top
R115  100K,1%  [0402-RES]  61.09,17.14 90 top
R116  100K,1%  [0402-RES]  53.47,17.14 270 top
R118  100K,1%  [0402-RES]  62.99,13.97 90 top
R120  100K,1%  [0402-RES]  61.09,13.97 90 top
R122  100K,1%  [0402-RES]  59.18,13.97 90 top
R125  100K,1%  [0402-RES]  57.28,13.97 90 top
R127  100K,1%  [0402-RES]  55.37,13.97 90 top
R129  100K,1%  [0402-RES]  53.47,13.97 90 top
R131  100K,1%  [0402-RES]  51.56,13.97 90 top
R133  100K,1%  [0402-RES]  49.66,13.97 90 top
R135  100K,1%  [0402-RES]  47.75,13.97 90 top
R137  100K,1%  [0402-RES]  45.85,13.97 90 top
R139  100K,1%  [0402-RES]  43.94,13.97 90 top
R140  100K,1%  [0402-RES]  42.04,13.97 90 top
R143  100K,1%  [0402-RES]  55.37,17.14 270 top
R144  33  [0402-RES]  62.99,10.8 90 top
R145  33  [0402-RES]  61.09,10.8 90 top
R146  0  [0402-RES]  59.18,10.8 90 top
R147  0  [0402-RES]  57.28,10.8 90 top
R148  100  [0402-RES]  55.37,10.8 90 top
R149  0  [0402-RES]  53.47,10.8 90 top
R150  0  [0402-RES]  40.13,13.97 90 top
R151  10K,1%  [0402-RES]  38.23,13.97 90 top
R152  0  [0402-RES]  36.32,13.97 90 top
R153  0,DNI  [0402-RES]  50.93,15.88 0 top
R154  0  [0402-RES]  50.29,11.43 0 top
R155  0,DNI  [0402-RES]  16,11.43 90 top
R156  33  [0402-RES]  38.86,15.88 0 top
R157  10K,1%,DNI  [0402-RES]  14.73,11.43 90 top
R158  10K,1%  [0402-RES]  56.01,40 0 top
RED  RED  [LED-0603]  1.71,35.24 270 top
RESET  SWITCH-MOMENTARY-2SMD-1101NE  [TACTILE-SWITCH-1101NE]  5.21,10.8 0 top
SIP  OSD3358  [OSD3358]  47.43,26.67 270 bottom
SPI1.1  JST_SH_6  [JST_SH_6]  34.1,19.69 90 top
SPI1.2  JST_SH_6  [JST_SH_6]  40.45,19.69 90 top
TP1  TPSQB1,27  [B1,27]  59.82,10.16 0 bottom
TP2  TPSQB1,27  [B1,27]  57.28,10.16 0 bottom
TP3  TPSQB1,27  [B1,27]  59.82,7.62 0 bottom
TP4  TPSQB1,27  [B1,27]  57.28,7.62 0 bottom
TP5  TPSQB1,27  [B1,27]  40.77,42.55 0 bottom
TP6  TPSQB1,27  [B1,27]  54.74,10.16 0 bottom
TP7  TPSQB1,27  [B1,27]  54.74,7.62 0 bottom
TP8  TPSQB1,27  [B1,27]  35.69,10.16 0 bottom
TP9  TPSQB1,27  [B1,27]  35.69,7.62 0 bottom
TP10  TPSQB1,27  [B1,27]  35.69,5.08 0 bottom
TP11  TPSQB1,27  [B1,27]  35.69,2.54 0 bottom
TP12  TPSQB1,27  [B1,27]  16,27.94 0 top
TP13  TPSQB1,27  [B1,27]  21.08,36.83 0 bottom
TP14  TPSQB1,27  [B1,27]  43.31,42.55 0 bottom
TP15  TPSQB1,27  [B1,27]  45.85,42.55 0 bottom
TP16  TPSQB1,27  [B1,27]  48.39,42.55 0 bottom
TP17  TPSQB1,27  [B1,27]  48.39,45.09 0 bottom
TP18  TPSQB1,27  [B1,27]  50.93,42.55 0 bottom
TP19  TPSQB1,27  [B1,27]  53.47,42.55 0 bottom
TP20  TPSQB1,27  [B1,27]  50.93,45.09 0 bottom
U1  TPD4S012_DRY_6  [DRY6]  45.85,11.43 0 top
U4  TPD4S012_DRY_6  [DRY6]  24.89,15.88 0 top
U5  24LC_32AT-I/OT  [SOT95P290X145-5N]  25.53,36.2 0 bottom
U6  SN74LVC1G07_DCK_5  [DCK5]  12.19,11.43 0 top
U7  TPS2051B_D_8  [D8]  14.1,15.88 0 top
U8  MTFC4GLDEA  [MTFC4GLDEA]  44.58,6.67 270 bottom
U$1  SERVO_HEADERS_8X  [3X8_0.1"_HEADER]  72.52,49.53 0 top
U$5  [XYZ_BIG]  18.41,31.62 90 top
UART0  JST_SH_4  [JST_SH_4_SMD]  65.85,23.5 90 top
UART1  JST_SH_4  [JST_SH_4_SMD]  59.82,23.5 90 top
UART5  JST_SH_4  [JST_SH_4_SMD]  54.1,23.5 90 top
Y1  CM200C-32.768KAZF-UT  [CM200C-32.768KAZF-UT]  25.21,29.21 180 bottom
Y2  445C33D24M00000  [445C33D24M00000]  33.78,36.83 270 bottom

## Tracks (layer width: path | path; a pad name or v marks a point on that pad's centre or on a via)
3.3V  (36 unrouted)
5.0V  (7 unrouted)
AIN0  (1 unrouted)
AIN1  (1 unrouted)
AIN2  (1 unrouted)
AIN3  (1 unrouted)
BATT_MID  (3 unrouted)
BATT_MINUS  (11 unrouted)
CHG_EN  (2 unrouted)
CO  (1 unrouted)
DO  (1 unrouted)
GND  (248 unrouted)
GNDA_ADC  (5 unrouted)
I2C0_SCL  (3 unrouted)
I2C0_SDA  (3 unrouted)
I2C1_SCL  (2 unrouted)
I2C1_SDA  (2 unrouted)
I2C2_SCL  (3 unrouted)
I2C2_SDA  (3 unrouted)
IMU_INT  (1 unrouted)
L3  (1 unrouted)
L4  (1 unrouted)
LDO_PGOOD  (1 unrouted)
LED_1  (1 unrouted)
LED_2  (2 unrouted)
LED_3  (1 unrouted)
LED_4  (1 unrouted)
LED_GRN  (1 unrouted)
LED_RED  (1 unrouted)
MDIR_1A  (1 unrouted)
MDIR_1B  (1 unrouted)
MDIR_2A  (1 unrouted)
MDIR_2B  (2 unrouted)
MDIR_3A  (2 unrouted)
MDIR_3B  (3 unrouted)
MDIR_4A  (2 unrouted)
MDIR_4B  (2 unrouted)
MODE_BTN  (1 unrouted)
MOT1A  (2 unrouted)
MOT1B  (2 unrouted)
MOT2A  (2 unrouted)
MOT2B  (2 unrouted)
MOT3A  (2 unrouted)
MOT3B  (2 unrouted)
MOT4A  (2 unrouted)
MOT4B  (2 unrouted)
MOT_STBY  (2 unrouted)
N$1  (1 unrouted)
N$2  (1 unrouted)
N$3  (1 unrouted)
N$4  (3 unrouted)
N$5  (2 unrouted)
N$6  (1 unrouted)
N$7  (1 unrouted)
N$8  (2 unrouted)
N$9  (1 unrouted)
N$10  (1 unrouted)
N$11  (2 unrouted)
N$12  (2 unrouted)
N$13  (1 unrouted)
N$14  (1 unrouted)
N$15  (1 unrouted)
N$16  (2 unrouted)
N$17  (1 unrouted)
N$18  (1 unrouted)
N$19  (1 unrouted)
N$20  (1 unrouted)
N$21  (1 unrouted)
N$22  (1 unrouted)
N$23  (1 unrouted)
N$24  (1 unrouted)
N$25  (1 unrouted)
N$26  (2 unrouted)
N$27  (2 unrouted)
N$28  (2 unrouted)
N$29  (2 unrouted)
N$30  (1 unrouted)
N$31  (2 unrouted)
N$32  (2 unrouted)
N$33  (2 unrouted)
N$34  (2 unrouted)
N$35  (1 unrouted)
N$36  (1 unrouted)
N$37  (1 unrouted)
N$38  (1 unrouted)
N$39  (1 unrouted)
N$40  (1 unrouted)
N$41  (1 unrouted)
N$42  (2 unrouted)
N$43  (1 unrouted)
N$44  (1 unrouted)
N$45  (1 unrouted)
N$46  (1 unrouted)
N$47  (1 unrouted)
N$48  (1 unrouted)
N$49  (1 unrouted)
N$50  (1 unrouted)
N$51  (1 unrouted)
N$52  (1 unrouted)
N$53  (1 unrouted)
N$54  (1 unrouted)
N$55  (2 unrouted)
N$56  (1 unrouted)
N$57  (1 unrouted)
N$58  (1 unrouted)
N$59  (1 unrouted)
N$60  (3 unrouted)
N$61  (1 unrouted)
N$62  (10 unrouted)
N$63  (1 unrouted)
N$64  (2 unrouted)
N$65  (2 unrouted)
N$66  (1 unrouted)
N$67  (2 unrouted)
N$68  (1 unrouted)
N$69  (1 unrouted)
N$70  (2 unrouted)
N$71  (2 unrouted)
N$72  (1 unrouted)
N$73  (2 unrouted)
N$74  (2 unrouted)
N$75  (2 unrouted)
N$76  (1 unrouted)
N$77  (2 unrouted)
N$78  (1 unrouted)
N$79  (3 unrouted)
N$80  (1 unrouted)
N$81  (1 unrouted)
N$82  (1 unrouted)
N$83  (1 unrouted)
N$84  (1 unrouted)
N$85  (1 unrouted)
N$86  (1 unrouted)
N$87  (1 unrouted)
N$88  (2 unrouted)
N$89  (2 unrouted)
N$90  (2 unrouted)
N$91  (2 unrouted)
N$92  (2 unrouted)
N$93  (2 unrouted)
N$94  (2 unrouted)
N$95  (2 unrouted)
N$96  (2 unrouted)
N$97  (2 unrouted)
N$98  (2 unrouted)
N$99  (1 unrouted)
N$100  (1 unrouted)
N$101  (1 unrouted)
N$102  (1 unrouted)
N$103  (1 unrouted)
N$104  (1 unrouted)
N$105  (1 unrouted)
N$106  (1 unrouted)
N$107  (1 unrouted)
N$108  (1 unrouted)
N$109  (1 unrouted)
N$110  (3 unrouted)
N$111  (1 unrouted)
N$112  (1 unrouted)
N$113  (1 unrouted)
N$114  (1 unrouted)
N$115  (2 unrouted)
N$116  (1 unrouted)
N$117  (2 unrouted)
N$118  (2 unrouted)
N$119  (2 unrouted)
N$120  (2 unrouted)
N$121  (1 unrouted)
N$122  (7 unrouted)
N$123  (2 unrouted)
N$124  (2 unrouted)
N$125  (2 unrouted)
N$126  (1 unrouted)
N$127  (4 unrouted)
N$128  (1 unrouted)
N$129  (1 unrouted)
N$130  (1 unrouted)
N$131  (1 unrouted)
N$132  (via drill 3.17)
  other vias: 14.61,51.44
N$133  (via drill 3.17)
  other vias: 14.61,3.17
N$134  (via drill 3.17)
  other vias: 80.64,48.26
N$135  (via drill 3.17)
  other vias: 80.64,6.35
N$141  (2 unrouted)
N$144  (2 unrouted)
N$150  (1 unrouted)
N$153  (2 unrouted)
N$156  (2 unrouted)
NTE  (2 unrouted)
PAUSE_BTN  (1 unrouted)
PMIC_INT  (1 unrouted)
PMIC_NWAKEUP  (1 unrouted)
PMIC_PGOOD  (2 unrouted)
PWM_1A  (1 unrouted)
PWM_1B  (1 unrouted)
PWM_2A  (1 unrouted)
PWM_2B  (1 unrouted)
PWR  (1 unrouted)
PWR_LEDR  (1 unrouted)
QEP_0A  (2 unrouted)
QEP_0B  (2 unrouted)
QEP_1A  (2 unrouted)
QEP_1B  (2 unrouted)
QEP_2A  (2 unrouted)
QEP_2B  (2 unrouted)
QEP_4A  (2 unrouted)
QEP_4B  (2 unrouted)
RESET  (4 unrouted)
SERVO_EN  (3 unrouted)
SPI1_MISO  (2 unrouted)
SPI1_MOSI  (2 unrouted)
SPI1_SCK  (2 unrouted)
SPI1_SS1  (1 unrouted)
SPI1_SS2  (1 unrouted)
SVO1  (2 unrouted)
SVO2  (2 unrouted)
SVO3  (2 unrouted)
SVO4  (2 unrouted)
SVO5  (3 unrouted)
SVO6  (3 unrouted)
SVO7  (3 unrouted)
SVO8  (3 unrouted)
SYS_5V  (3 unrouted)
UART0_RX  (1 unrouted)
UART0_TX  (1 unrouted)
UART1_RX  (1 unrouted)
UART1_TX  (1 unrouted)
UART2_RX  (1 unrouted)
UART2_TX  (1 unrouted)
UART4_RX  (1 unrouted)
UART5_RX  (1 unrouted)
UART5_TX  (1 unrouted)
USB0_VBUS  (3 unrouted)
USB_DC  (2 unrouted)
V_BATT  (17 unrouted)
V_DIV_BAT  (2 unrouted)
V_DIV_DC  (2 unrouted)
VCC  (6 unrouted)
VCC_3V3B  (9 unrouted)
VCC_CHG  (3 unrouted)
VDD_1V8  (3 unrouted)
VDD_3V3A  (32 unrouted)
VDD_3V3AUX  (1 unrouted)
VDD_3V3B  (28 unrouted)
VDD_ADC  (5 unrouted)
VDD_RTC  (8 unrouted)